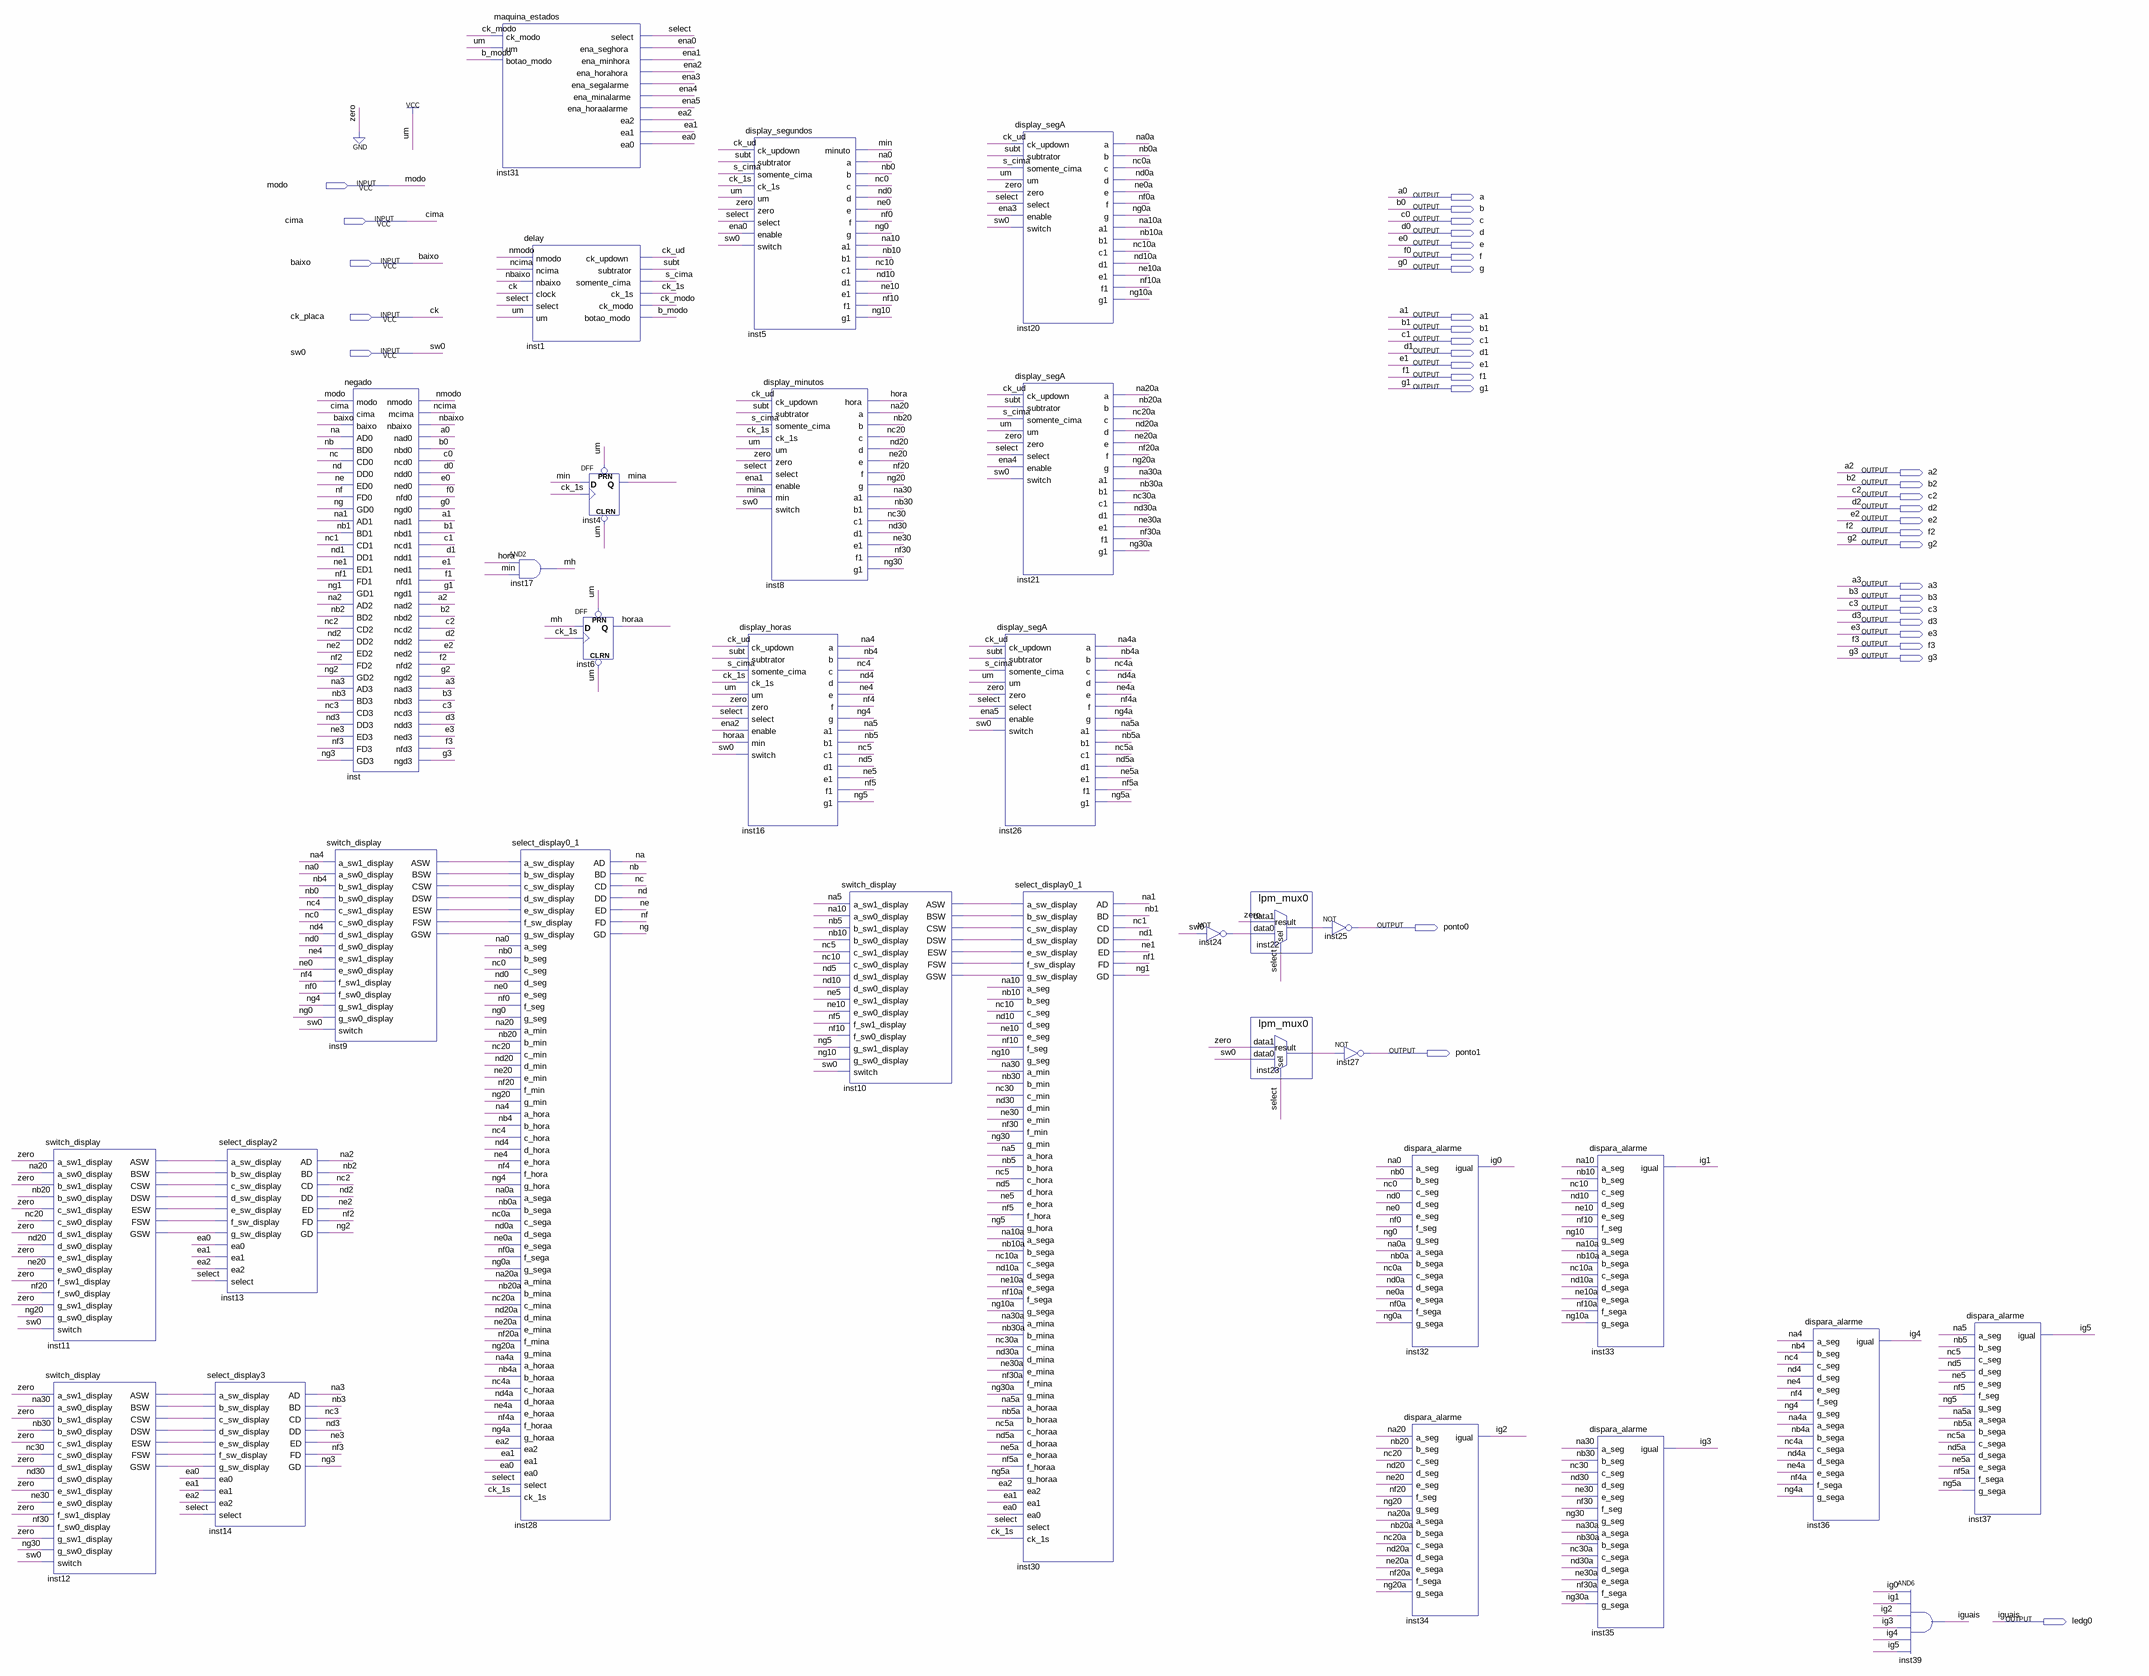
[diagram p0: schematic sheet]
// Quartus schematic relogio.bdf as structural Verilog: 32 symbols, 36 pins
module relogio (
  input  modo,
  input  cima,
  input  baixo,
  input  ck_placa,
  input  sw0,
  output a,
  output b,
  output c,
  output d,
  output e,
  output f,
  output g,
  output a1,
  output b1,
  output c1,
  output d1,
  output e1,
  output f1,
  output g1,
  output a2,
  output b2,
  output c2,
  output d2,
  output e2,
  output f2,
  output g2,
  output a3,
  output b3,
  output c3,
  output d3,
  output e3,
  output f3,
  output g3,
  output ponto0,
  output ponto1,
  output ledg0
);

  wire b_modo, ck_1s, ck_modo, ck_ud, ea0, ea1, ea2, ena0, ena1, ena2, ena3, ena4, ena5, hora, horaa, ig0,
       ig1, ig2, ig3, ig4, ig5, inst9_asw, inst9_bsw, inst9_csw, inst9_dsw, inst9_esw, inst9_fsw, inst9_gsw,
       inst10_asw, inst10_bsw, inst10_csw, inst10_dsw, inst10_esw, inst10_fsw, inst10_gsw, inst11_asw,
       inst11_bsw, inst11_csw, inst11_dsw, inst11_esw, inst11_fsw, inst11_gsw, inst12_asw, inst12_bsw,
       inst12_csw, inst12_dsw, inst12_esw, inst12_fsw, inst12_gsw, inst22_result, inst23_result, inst24_out,
       mh, min, mina, na, na0, na0a, na1, na2, na3, na4, na4a, na5, na5a, na10, na10a, na20, na20a, na30,
       na30a, nb, nb0, nb0a, nb1, nb2, nb3, nb4, nb4a, nb5, nb5a, nb10, nb10a, nb20, nb20a, nb30, nb30a,
       nbaixo, nc, nc0, nc0a, nc1, nc2, nc3, nc4, nc4a, nc5, nc5a, nc10, nc10a, nc20, nc20a, nc30, nc30a,
       ncima, nd, nd0, nd0a, nd1, nd2, nd3, nd4, nd4a, nd5, nd5a, nd10, nd10a, nd20, nd20a, nd30, nd30a, ne,
       ne0, ne0a, ne1, ne2, ne3, ne4, ne4a, ne5, ne5a, ne10, ne10a, ne20, ne20a, ne30, ne30a, nf, nf0, nf0a,
       nf1, nf2, nf3, nf4, nf4a, nf5, nf5a, nf10, nf10a, nf20, nf20a, nf30, nf30a, ng, ng0, ng0a, ng1, ng2,
       ng3, ng4, ng4a, ng5, ng5a, ng10, ng10a, ng20, ng20a, ng30, ng30a, nmodo, s_cima, select, subt;

  switch_display inst11 (
    .a_sw1_display(1'b0), .a_sw0_display(na20), .b_sw1_display(1'b0), .b_sw0_display(nb20),
    .c_sw1_display(1'b0), .c_sw0_display(nc20), .d_sw1_display(1'b0), .d_sw0_display(nd20),
    .e_sw1_display(1'b0), .e_sw0_display(ne20), .f_sw1_display(1'b0), .f_sw0_display(nf20),
    .g_sw1_display(1'b0), .g_sw0_display(ng20), .switch(sw0), .ASW(inst11_asw), .BSW(inst11_bsw),
    .CSW(inst11_csw), .DSW(inst11_dsw), .ESW(inst11_esw), .FSW(inst11_fsw), .GSW(inst11_gsw));
  switch_display inst12 (
    .a_sw1_display(1'b0), .a_sw0_display(na30), .b_sw1_display(1'b0), .b_sw0_display(nb30),
    .c_sw1_display(1'b0), .c_sw0_display(nc30), .d_sw1_display(1'b0), .d_sw0_display(nd30),
    .e_sw1_display(1'b0), .e_sw0_display(ne30), .f_sw1_display(1'b0), .f_sw0_display(nf30),
    .g_sw1_display(1'b0), .g_sw0_display(ng30), .switch(sw0), .ASW(inst12_asw), .BSW(inst12_bsw),
    .CSW(inst12_csw), .DSW(inst12_dsw), .ESW(inst12_esw), .FSW(inst12_fsw), .GSW(inst12_gsw));
  select_display2 inst13 (
    .a_sw_display(inst11_asw), .b_sw_display(inst11_bsw), .c_sw_display(inst11_csw),
    .d_sw_display(inst11_dsw), .e_sw_display(inst11_esw), .f_sw_display(inst11_fsw),
    .g_sw_display(inst11_gsw), .ea0(ea0), .ea1(ea1), .ea2(ea2), .select(select), .AD(na2), .BD(nb2),
    .CD(nc2), .DD(nd2), .ED(ne2), .FD(nf2), .GD(ng2));
  select_display3 inst14 (
    .a_sw_display(inst12_asw), .b_sw_display(inst12_bsw), .c_sw_display(inst12_csw),
    .d_sw_display(inst12_dsw), .e_sw_display(inst12_esw), .f_sw_display(inst12_fsw),
    .g_sw_display(inst12_gsw), .ea0(ea0), .ea1(ea1), .ea2(ea2), .select(select), .AD(na3), .BD(nb3),
    .CD(nc3), .DD(nd3), .ED(ne3), .FD(nf3), .GD(ng3));
  switch_display inst9 (
    .a_sw1_display(na4), .a_sw0_display(na0), .b_sw1_display(nb4), .b_sw0_display(nb0), .c_sw1_display(nc4),
    .c_sw0_display(nc0), .d_sw1_display(nd4), .d_sw0_display(nd0), .e_sw1_display(ne4), .e_sw0_display(ne0),
    .f_sw1_display(nf4), .f_sw0_display(nf0), .g_sw1_display(ng4), .g_sw0_display(ng0), .switch(sw0),
    .ASW(inst9_asw), .BSW(inst9_bsw), .CSW(inst9_csw), .DSW(inst9_dsw), .ESW(inst9_esw), .FSW(inst9_fsw),
    .GSW(inst9_gsw));
  negado inst (
    .modo(modo), .cima(cima), .baixo(baixo), .AD0(na), .BD0(nb), .CD0(nc), .DD0(nd), .ED0(ne), .FD0(nf),
    .GD0(ng), .AD1(na1), .BD1(nb1), .CD1(nc1), .DD1(nd1), .ED1(ne1), .FD1(nf1), .GD1(ng1), .AD2(na2),
    .BD2(nb2), .CD2(nc2), .DD2(nd2), .ED2(ne2), .FD2(nf2), .GD2(ng2), .AD3(na3), .BD3(nb3), .CD3(nc3),
    .DD3(nd3), .ED3(ne3), .FD3(nf3), .GD3(ng3), .nmodo(nmodo), .mcima(ncima), .nbaixo(nbaixo), .nad0(a),
    .nbd0(b), .ncd0(c), .ndd0(d), .ned0(e), .nfd0(f), .ngd0(g), .nad1(a1), .nbd1(b1), .ncd1(c1), .ndd1(d1),
    .ned1(e1), .nfd1(f1), .ngd1(g1), .nad2(a2), .nbd2(b2), .ncd2(c2), .ndd2(d2), .ned2(e2), .nfd2(f2),
    .ngd2(g2), .nad3(a3), .nbd3(b3), .ncd3(c3), .ndd3(d3), .ned3(e3), .nfd3(f3), .ngd3(g3));
  maquina_estados inst31 (
    .ck_modo(ck_modo), .um(1'b1), .botao_modo(b_modo), .select(select), .ena_seghora(ena0),
    .ena_minhora(ena1), .ena_horahora(ena2), .ena_segalarme(ena3), .ena_minalarme(ena4),
    .ena_horaalarme(ena5), .ea2(ea2), .ea1(ea1), .ea0(ea0));
  and inst17 (mh, hora, min);
  select_display0_1 inst28 (
    .a_sw_display(inst9_asw), .b_sw_display(inst9_bsw), .c_sw_display(inst9_csw), .d_sw_display(inst9_dsw),
    .e_sw_display(inst9_esw), .f_sw_display(inst9_fsw), .g_sw_display(inst9_gsw), .a_seg(na0), .b_seg(nb0),
    .c_seg(nc0), .d_seg(nd0), .e_seg(ne0), .f_seg(nf0), .g_seg(ng0), .a_min(na20), .b_min(nb20),
    .c_min(nc20), .d_min(nd20), .e_min(ne20), .f_min(nf20), .g_min(ng20), .a_hora(na4), .b_hora(nb4),
    .c_hora(nc4), .d_hora(nd4), .e_hora(ne4), .f_hora(nf4), .g_hora(ng4), .a_sega(na0a), .b_sega(nb0a),
    .c_sega(nc0a), .d_sega(nd0a), .e_sega(ne0a), .f_sega(nf0a), .g_sega(ng0a), .a_mina(na20a),
    .b_mina(nb20a), .c_mina(nc20a), .d_mina(nd20a), .e_mina(ne20a), .f_mina(nf20a), .g_mina(ng20a),
    .a_horaa(na4a), .b_horaa(nb4a), .c_horaa(nc4a), .d_horaa(nd4a), .e_horaa(ne4a), .f_horaa(nf4a),
    .g_horaa(ng4a), .ea2(ea2), .ea1(ea1), .ea0(ea0), .select(select), .ck_1s(ck_1s), .AD(na), .BD(nb),
    .CD(nc), .DD(nd), .ED(ne), .FD(nf), .GD(ng));
  delay inst1 (
    .nmodo(nmodo), .ncima(ncima), .nbaixo(nbaixo), .clock(ck_placa), .select(select), .um(1'b1),
    .ck_updown(ck_ud), .subtrator(subt), .somente_cima(s_cima), .ck_1s(ck_1s), .ck_modo(ck_modo),
    .botao_modo(b_modo));
  DFF inst4 (.CLRN(1'b1), .CLK(ck_1s), .D(min), .PRN(1'b1), .Q(mina));
  DFF inst6 (.CLRN(1'b1), .CLK(ck_1s), .D(mh), .PRN(1'b1), .Q(horaa));
  display_segundos inst5 (
    .ck_updown(ck_ud), .subtrator(subt), .somente_cima(s_cima), .ck_1s(ck_1s), .um(1'b1), .zero(1'b0),
    .select(select), .enable(ena0), .switch(sw0), .minuto(min), .a(na0), .b(nb0), .c(nc0), .d(nd0), .e(ne0),
    .f(nf0), .g(ng0), .a1(na10), .b1(nb10), .c1(nc10), .d1(nd10), .e1(ne10), .f1(nf10), .g1(ng10));
  display_horas inst16 (
    .ck_updown(ck_ud), .subtrator(subt), .somente_cima(s_cima), .ck_1s(ck_1s), .um(1'b1), .zero(1'b0),
    .select(select), .enable(ena2), .min(horaa), .switch(sw0), .a(na4), .b(nb4), .c(nc4), .d(nd4), .e(ne4),
    .f(nf4), .g(ng4), .a1(na5), .b1(nb5), .c1(nc5), .d1(nd5), .e1(ne5), .f1(nf5), .g1(ng5));
  display_minutos inst8 (
    .ck_updown(ck_ud), .subtrator(subt), .somente_cima(s_cima), .ck_1s(ck_1s), .um(1'b1), .zero(1'b0),
    .select(select), .enable(ena1), .min(mina), .switch(sw0), .hora(hora), .a(na20), .b(nb20), .c(nc20),
    .d(nd20), .e(ne20), .f(nf20), .g(ng20), .a1(na30), .b1(nb30), .c1(nc30), .d1(nd30), .e1(ne30), .f1(nf30),
    .g1(ng30));
  switch_display inst10 (
    .a_sw1_display(na5), .a_sw0_display(na10), .b_sw1_display(nb5), .b_sw0_display(nb10),
    .c_sw1_display(nc5), .c_sw0_display(nc10), .d_sw1_display(nd5), .d_sw0_display(nd10),
    .e_sw1_display(ne5), .e_sw0_display(ne10), .f_sw1_display(nf5), .f_sw0_display(nf10),
    .g_sw1_display(ng5), .g_sw0_display(ng10), .switch(sw0), .ASW(inst10_asw), .BSW(inst10_bsw),
    .CSW(inst10_csw), .DSW(inst10_dsw), .ESW(inst10_esw), .FSW(inst10_fsw), .GSW(inst10_gsw));
  display_segA inst26 (
    .ck_updown(ck_ud), .subtrator(subt), .somente_cima(s_cima), .um(1'b1), .zero(1'b0), .select(select),
    .enable(ena5), .switch(sw0), .a(na4a), .b(nb4a), .c(nc4a), .d(nd4a), .e(ne4a), .f(nf4a), .g(ng4a),
    .a1(na5a), .b1(nb5a), .c1(nc5a), .d1(nd5a), .e1(ne5a), .f1(nf5a), .g1(ng5a));
  display_segA inst20 (
    .ck_updown(ck_ud), .subtrator(subt), .somente_cima(s_cima), .um(1'b1), .zero(1'b0), .select(select),
    .enable(ena3), .switch(sw0), .a(na0a), .b(nb0a), .c(nc0a), .d(nd0a), .e(ne0a), .f(nf0a), .g(ng0a),
    .a1(na10a), .b1(nb10a), .c1(nc10a), .d1(nd10a), .e1(ne10a), .f1(nf10a), .g1(ng10a));
  display_segA inst21 (
    .ck_updown(ck_ud), .subtrator(subt), .somente_cima(s_cima), .um(1'b1), .zero(1'b0), .select(select),
    .enable(ena4), .switch(sw0), .a(na20a), .b(nb20a), .c(nc20a), .d(nd20a), .e(ne20a), .f(nf20a), .g(ng20a),
    .a1(na30a), .b1(nb30a), .c1(nc30a), .d1(nd30a), .e1(ne30a), .f1(nf30a), .g1(ng30a));
  select_display0_1 inst30 (
    .a_sw_display(inst10_asw), .b_sw_display(inst10_bsw), .c_sw_display(inst10_csw),
    .d_sw_display(inst10_dsw), .e_sw_display(inst10_esw), .f_sw_display(inst10_fsw),
    .g_sw_display(inst10_gsw), .a_seg(na10), .b_seg(nb10), .c_seg(nc10), .d_seg(nd10), .e_seg(ne10),
    .f_seg(nf10), .g_seg(ng10), .a_min(na30), .b_min(nb30), .c_min(nc30), .d_min(nd30), .e_min(ne30),
    .f_min(nf30), .g_min(ng30), .a_hora(na5), .b_hora(nb5), .c_hora(nc5), .d_hora(nd5), .e_hora(ne5),
    .f_hora(nf5), .g_hora(ng5), .a_sega(na10a), .b_sega(nb10a), .c_sega(nc10a), .d_sega(nd10a),
    .e_sega(ne10a), .f_sega(nf10a), .g_sega(ng10a), .a_mina(na30a), .b_mina(nb30a), .c_mina(nc30a),
    .d_mina(nd30a), .e_mina(ne30a), .f_mina(nf30a), .g_mina(ng30a), .a_horaa(na5a), .b_horaa(nb5a),
    .c_horaa(nc5a), .d_horaa(nd5a), .e_horaa(ne5a), .f_horaa(nf5a), .g_horaa(ng5a), .ea2(ea2), .ea1(ea1),
    .ea0(ea0), .select(select), .ck_1s(ck_1s), .AD(na1), .BD(nb1), .CD(nc1), .DD(nd1), .ED(ne1), .FD(nf1),
    .GD(ng1));
  not inst24 (inst24_out, sw0);
  lpm_mux0 inst22 (.data1(1'b0), .data0(inst24_out), .sel(select), .result(inst22_result));
  lpm_mux0 inst23 (.data1(1'b0), .data0(sw0), .sel(select), .result(inst23_result));
  not inst25 (ponto0, inst22_result);
  not inst27 (ponto1, inst23_result);
  dispara_alarme inst32 (
    .a_seg(na0), .b_seg(nb0), .c_seg(nc0), .d_seg(nd0), .e_seg(ne0), .f_seg(nf0), .g_seg(ng0), .a_sega(na0a),
    .b_sega(nb0a), .c_sega(nc0a), .d_sega(nd0a), .e_sega(ne0a), .f_sega(nf0a), .g_sega(ng0a), .igual(ig0));
  dispara_alarme inst34 (
    .a_seg(na20), .b_seg(nb20), .c_seg(nc20), .d_seg(nd20), .e_seg(ne20), .f_seg(nf20), .g_seg(ng20),
    .a_sega(na20a), .b_sega(nb20a), .c_sega(nc20a), .d_sega(nd20a), .e_sega(ne20a), .f_sega(nf20a),
    .g_sega(ng20a), .igual(ig2));
  dispara_alarme inst33 (
    .a_seg(na10), .b_seg(nb10), .c_seg(nc10), .d_seg(nd10), .e_seg(ne10), .f_seg(nf10), .g_seg(ng10),
    .a_sega(na10a), .b_sega(nb10a), .c_sega(nc10a), .d_sega(nd10a), .e_sega(ne10a), .f_sega(nf10a),
    .g_sega(ng10a), .igual(ig1));
  dispara_alarme inst35 (
    .a_seg(na30), .b_seg(nb30), .c_seg(nc30), .d_seg(nd30), .e_seg(ne30), .f_seg(nf30), .g_seg(ng30),
    .a_sega(na30a), .b_sega(nb30a), .c_sega(nc30a), .d_sega(nd30a), .e_sega(ne30a), .f_sega(nf30a),
    .g_sega(ng30a), .igual(ig3));
  dispara_alarme inst36 (
    .a_seg(na4), .b_seg(nb4), .c_seg(nc4), .d_seg(nd4), .e_seg(ne4), .f_seg(nf4), .g_seg(ng4), .a_sega(na4a),
    .b_sega(nb4a), .c_sega(nc4a), .d_sega(nd4a), .e_sega(ne4a), .f_sega(nf4a), .g_sega(ng4a), .igual(ig4));
  and inst39 (ledg0, ig0, ig1, ig2, ig3, ig4, ig5);
  dispara_alarme inst37 (
    .a_seg(na5), .b_seg(nb5), .c_seg(nc5), .d_seg(nd5), .e_seg(ne5), .f_seg(nf5), .g_seg(ng5), .a_sega(na5a),
    .b_sega(nb5a), .c_sega(nc5a), .d_sega(nd5a), .e_sega(ne5a), .f_sega(nf5a), .g_sega(ng5a), .igual(ig5));

  // Other names for the same wires on the sheet: a0 = a; b0 = b; c0 = c; ck = ck_placa; d0 = d; e0 = e; f0 = f;
  //   g0 = g; iguais = ledg0
endmodule
